# Altium schematic sheet BuckBoost.SchDoc
size A; SheetNumber: 1; SheetTotal: 1
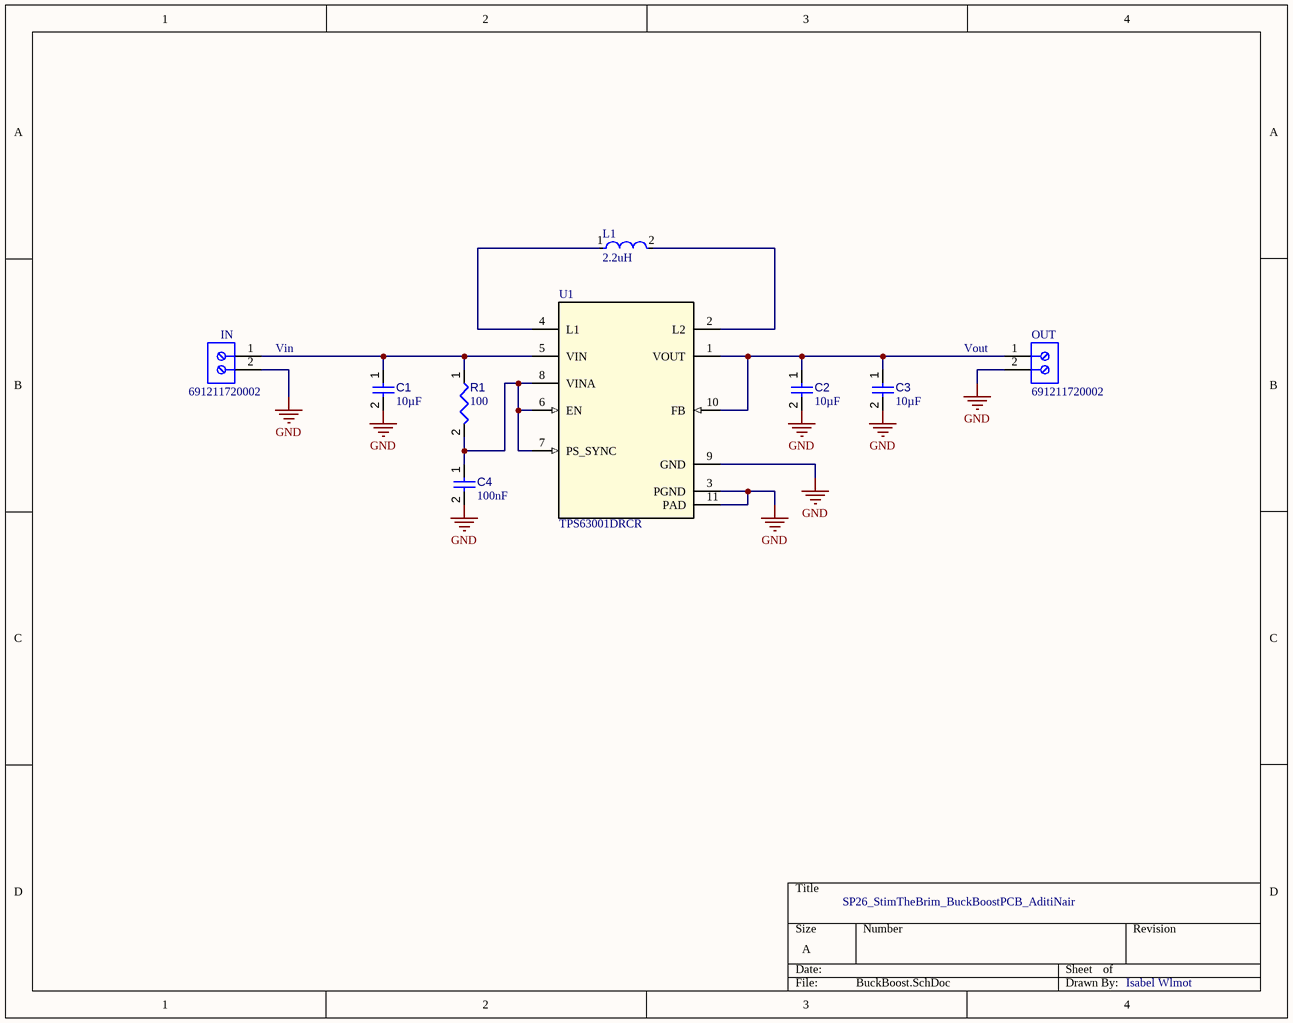
[diagram p0: BuckBoost.SchDoc]

## Parts
C1  value 10µF  [CAPC0805(2012)145_L]  (hidden comment: Capacitor 10µF +/-20% 25V 0805)
C2  value 10µF  [CAPC0805(2012)145_L]  (hidden comment: Capacitor 10µF +/-20% 25V 0805)
C3  value 10µF  [CAPC0805(2012)145_L]  (hidden comment: Capacitor 10µF +/-20% 25V 0805)
C4  value 100nF  [CAPC2013X95X50LL10T25]  (hidden comment: Capacitor 100 nF +/-10% 50 V 0805)
IN  691211720002  [691211720002]
L1  2.2uH  [FP-82103C-MFG]
OUT  691211720002  [691211720002]
R1  value 100  [RESC0402(1005)_L]  (hidden comment: Resistor 100R +/-1 % 0402 63 mW)
U1  TPS63001DRCR  [DRC0010J]

## Nets
GND: C1.2 C2.2 C3.2 C4.2 IN.2 OUT.2 U1.3(PGND) U1.9(GND) U1.11(PAD)
NetC1_1: C1.1 IN.1 R1.1 U1.5(VIN)
NetC2_1: C2.1 C3.1 OUT.1 U1.1(VOUT) U1.10(FB)
NetC4_1: C4.1 R1.2 U1.6(EN) U1.7(PS_SYNC) U1.8(VINA)
NetL1_1: L1.1 U1.4(L1)
NetL1_2: L1.2 U1.2(L2)

## Notes on the sheet
- (near IN) Vin
- (near OUT) Vout
- SP26_StimTheBrim_BuckBoostPCB_AditiNair
- Isabel Wlmot

## Library data of the parts
C1-C3 = CMP-001-00079-4: Chip Capacitor, 10µF +/-20%, 25V, 0805, Thickness 1.45 mm; Tolerance: 10%; Max Operating Temperature: 85°C; Case/Package: 0805; Voltage Rating: 25V; Min Operating Temperature: -55°C; Mounting Technology: SMT; Pins: 2
C4 = CMP-001-00018-6: Chip Capacitor, 100 nF, +/- 10%, 50 V, 0805 (2012 Metric); Capacitor Type: Ceramic; Voltage Rating: 50V; Pins: 2; Max Operating Temperature: 125°C; Min Operating Temperature: -55°C; Mounting Technology: SM; Case/Package: 0805; RoHS Compliant: True; Tolerance: 10%
IN OUT = CMP-1502-02524-3: 211 Series 5MM Pitch Straight, Pcb Terminal Block, Through Hole, 2 Way; Number of Levels: 1; Current: 10A; Voltage: 300V; Pitch: 5.0038mm; Wire Gauge (Min): 12AWG; Connector Type: PCB, Terminal Block; Number of Positions Per Level: 2; Plating: Brass, Steel; Wire Gauge (Max): 24AWG; Stripping Length: -7mm; Termination: Screw; Height: 15.5mm; Contact Plating: Tin; REACH SVHC: Unknown; Contact Material: Brass; Width: 10mm; RoHS: Compliant; Number of Pins: 2; Lead Pitch: 5mm; Mount: Through Hole; Min Operating Temperature: -40°C; Length: 13.7mm; Number of Contacts: 2; Color: Green; Wire/Cable Gauge: 12AWG; Housing Material: Nylon; Packaging: Box; Max Operating Temperature: 105°C
L1 = CMP-20514-000001-1: FIXED IND 10UH 500MA 400MOHM SMD; DC Resistance (DCR): 400mR; Test Frequency: 10kHz; Self Resonant Frequency: 38MHz; Q Factor: 35; Tolerance: 10%; Shielding: Unshielded; Case Code (Metric): 3225; Case Code (Imperial): 1210; Min Operating Temperature: -40°C; Military Standard: Not; Width: 0.098inch; Current Rating: 500mA; Termination: SMD/SMT; Resistor Type: Wirewound; DC Current: 500mA; Mount: Surface Mount; Max DC Current: 500mA; Packaging: Tape and Reel; Radiation Hardening: No; Depth: 2.7mm; Max Operating Temperature: 85°C; Height - Seated (Max): 0.092inch; RoHS Compliant: Yes; Series: 8200; Package Quantity: 1; Case/Package: 1210; Height: 2mm; Inductance: 10uH; Length: 0.126inch
R1 = CMP-009-00167-3: Chip Resistor, 100 Ohms, +/-1 %, 63 mW, -55 to 155 degC, 0402; Power: 63mW; Tolerance: 1%; Min Operating Temperature: -55°C; Case/Package: 0402; Pins: 2; Max Operating Temperature: 155°C
U1 = TPS63001DRCR: 96% Buck-Boost Converter with 1.7A Current Switches, 3.3V fixed Output voltage in 3x3 QFN 10-VSON -40 to 125; Manufacturer_Name: Texas Instruments; Alternate_PartNumber: TPS63001DRCT; CompType: IC; TYPE: TYPE; RefDes: RefDes; Copyright: Copyright (C) 2025 Ultra Librarian. All rights reserved.; Manufacturer_Part_Number: TPS63001DRCR; Application_BuildNumber: *; PartNumber: TPS63001DRCR; PackageReference: DRC0010J; MountType: SMT; RoHS: Y; Manufacturer: Texas Instruments